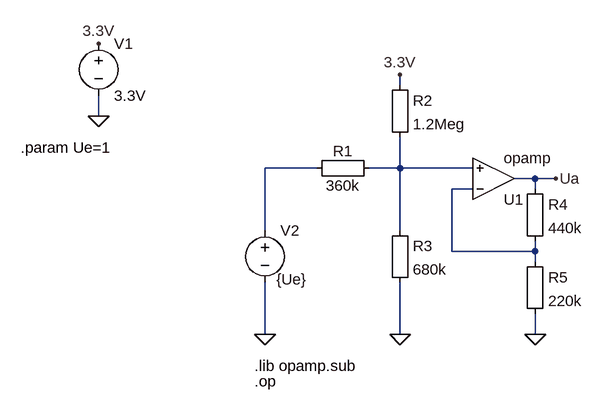
[diagram p0: schematic pm1Vsim.asc]
pm1Vsim.asc, the LTspice schematic file:
Version 4
SHEET 1 880 680
WIRE 528 192 528 176
WIRE 64 240 64 208
WIRE 400 320 320 320
WIRE 528 320 528 272
WIRE 528 320 480 320
WIRE 640 320 528 320
WIRE 736 336 704 336
WIRE 768 336 736 336
WIRE 640 352 608 352
WIRE 736 352 736 336
WIRE 320 416 320 320
WIRE 528 416 528 320
WIRE 608 448 608 352
WIRE 736 448 736 432
WIRE 736 448 608 448
WIRE 736 464 736 448
WIRE 320 576 320 496
WIRE 528 576 528 496
WIRE 736 576 736 544
FLAG 64 128 3.3V
FLAG 64 240 0
FLAG 320 576 0
FLAG 528 176 3.3V
FLAG 768 336 Ua
FLAG 736 576 0
FLAG 528 576 0
SYMBOL voltage 64 112 R0
WINDOW 123 0 0 Left 0
WINDOW 39 0 0 Left 0
SYMATTR InstName V1
SYMATTR Value 3.3V
SYMBOL Misc\\EuropeanResistor 496 304 R90
WINDOW 0 5 56 VBottom 2
WINDOW 3 27 56 VTop 2
SYMATTR InstName R1
SYMATTR Value 360k
SYMBOL Misc\\EuropeanResistor 512 176 R0
SYMATTR InstName R2
SYMATTR Value 1.2Meg
SYMBOL Misc\\EuropeanResistor 512 400 R0
SYMATTR InstName R3
SYMATTR Value 680k
SYMBOL voltage 320 400 R0
WINDOW 3 18 91 Left 2
WINDOW 123 0 0 Left 0
WINDOW 39 0 0 Left 0
SYMATTR Value {Ue}
SYMATTR InstName V2
SYMBOL OpAmps\\opamp 672 400 M180
SYMATTR InstName U1
SYMBOL Misc\\EuropeanResistor 720 336 R0
SYMATTR InstName R4
SYMATTR Value 440k
SYMBOL Misc\\EuropeanResistor 720 448 R0
SYMATTR InstName R5
SYMATTR Value 220k
TEXT 304 624 Left 2 !.lib opamp.sub
TEXT -56 288 Left 2 !.param Ue=1
TEXT 304 648 Left 2 !.op

The netlist it stands for:
* pm1Vsim.asc
V1 3.3V 0 3.3V
R1 N002 N001 360k
R2 3.3V N002 1.2Meg
R3 N002 0 680k
V2 N001 0 {Ue}
XU1 N003 N002 Ua opamp Aol=100K GBW=10Meg  ; pins invin noninvin out
R4 Ua N003 440k
R5 N003 0 220k
.lib opamp.sub
.param Ue=1
.op
.backanno
.end